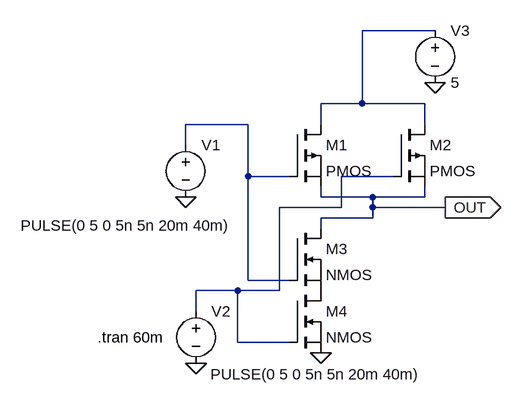
[diagram p0: schematic 2in-NAND GATE.asc]
2in-NAND GATE.asc, the LTspice schematic file:
Version 4.1
SHEET 1 880 680
WIRE 304 -80 192 -80
WIRE 192 32 192 -80
WIRE 192 32 128 32
WIRE 288 32 192 32
WIRE 16 64 -80 64
WIRE 128 64 128 32
WIRE 288 64 288 32
WIRE -80 96 -80 64
WIRE 16 144 16 64
WIRE 80 144 16 144
WIRE 240 144 160 144
WIRE 128 176 128 160
WIRE 208 176 128 176
WIRE 288 176 288 160
WIRE 288 176 208 176
WIRE 160 192 160 144
WIRE 160 192 64 192
WIRE 208 192 208 176
WIRE 320 192 208 192
WIRE 208 208 208 192
WIRE 208 208 128 208
WIRE 128 224 128 208
WIRE 16 304 16 144
WIRE 80 304 16 304
WIRE 0 320 -64 320
WIRE 64 320 64 192
WIRE 64 320 0 320
WIRE -64 352 -64 320
WIRE 0 400 0 320
WIRE 80 400 0 400
FLAG 128 416 0
FLAG 320 192 OUT
IOPIN 320 192 Out
FLAG -80 176 0
FLAG -64 432 0
FLAG 304 0 0
SYMBOL pmos 80 64 R0
SYMATTR InstName M1
SYMBOL pmos 240 64 R0
SYMATTR InstName M2
SYMBOL nmos 80 224 R0
SYMATTR InstName M3
SYMBOL nmos 80 320 R0
SYMATTR InstName M4
SYMBOL voltage -80 80 R0
WINDOW 3 -254 140 Left 2
WINDOW 123 0 0 Left 0
WINDOW 39 0 0 Left 0
SYMATTR InstName V1
SYMATTR Value PULSE(0 5 0 5n 5n 20m 40m)
SYMBOL voltage -64 336 R0
WINDOW 3 22 113 Left 2
WINDOW 123 0 0 Left 0
WINDOW 39 0 0 Left 0
SYMATTR InstName V2
SYMATTR Value PULSE(0 5 0 5n 5n 20m 40m)
SYMBOL voltage 304 -96 R0
WINDOW 123 0 0 Left 0
WINDOW 39 0 0 Left 0
SYMATTR InstName V3
SYMATTR Value 5
TEXT -216 392 Left 2 !.tran 60m

The netlist it stands for:
* 2in-NAND GATE.asc
M1 N001 N002 OUT OUT PMOS
M2 N001 N003 OUT OUT PMOS
M3 OUT N002 P001 P001 NMOS
M4 P001 N003 0 0 NMOS
V1 N002 0 PULSE(0 5 0 5n 5n 20m 40m)
V2 N003 0 PULSE(0 5 0 5n 5n 20m 40m)
V3 N001 0 5
.model NMOS NMOS
.model PMOS PMOS
.lib standard.mos
.tran 60m
.backanno
.end